# EAGLE design 3phase-boiler-controller-arduino (EAGLE 7.2.0)
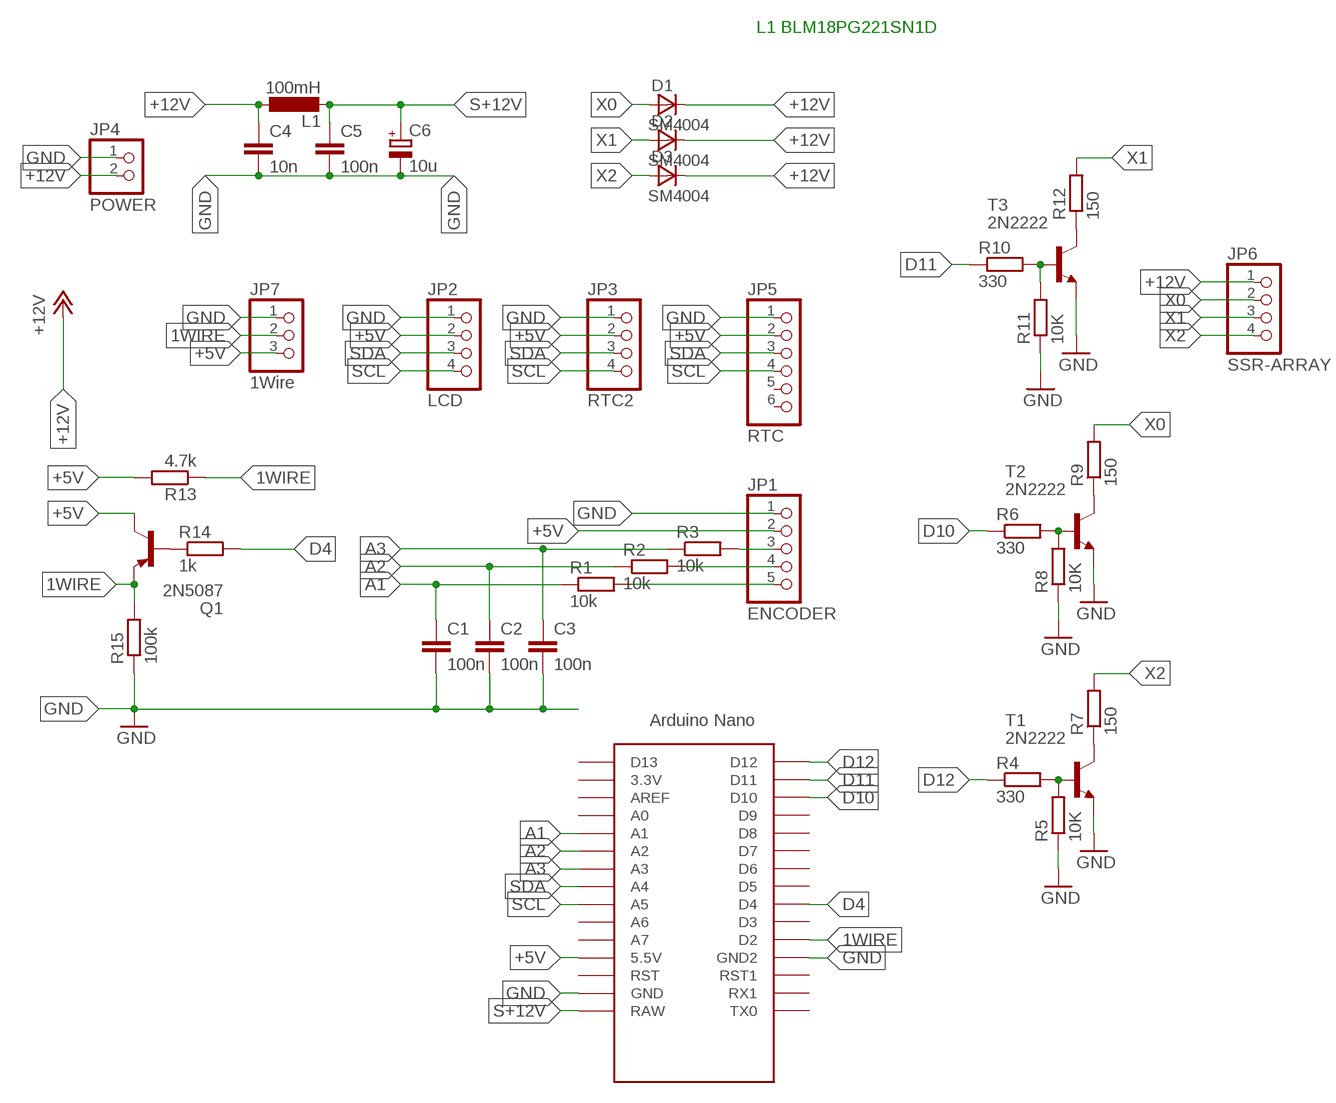
[diagram p0: schematic, sheet 1]

## Parts
C1  100n  C-EUC0603  [C0603]
C2  100n  C-EUC0603  [C0603]
C3  100n  C-EUC0603  [C0603]
C4  10n  C-EUC0603  [C0603]
C5  100n  C-EUC0603  [C0603]
C6  10u  CPOL-EU153CLV-0807  [153CLV-0807]
D1  SM4004  [MELF-MLL41]
D2  SM4004  [MELF-MLL41]
D3  SM4004  [MELF-MLL41]
JP1  ENCODER  PINHD-1X5  [1X05]
JP2  LCD  PINHD-1X4  [1X04]
JP3  RTC2  PINHD-1X4  [1X04]
JP4  POWER  PINHD-1X2  [1X02]
JP5  RTC  PINHD-1X6/90  [1X06/90]
JP6  SSR-ARRAY  PINHD-1X4  [1X04]
JP7  1Wire  PINHD-1X3  [1X03]
L1  100mH  L-EU0207/12  [0207/12]
Q1  2N5087  [TO92]
R1  10k  R-EU_R0805  [R0805]
R2  10k  R-EU_R0805  [R0805]
R3  10k  R-EU_R0805  [R0805]
R4  330  R-EU_R0805  [R0805]
R5  10K  R-EU_R0805  [R0805]
R6  330  R-EU_R0805  [R0805]
R7  150  R-EU_R0805  [R0805]
R8  10K  R-EU_R0805  [R0805]
R9  150  R-EU_R0805  [R0805]
R10  330  R-EU_R0805  [R0805]
R11  10K  R-EU_R0805  [R0805]
R12  150  R-EU_R0805  [R0805]
R13  4.7k  R-EU_R0805  [R0805]
R14  1k  R-EU_R0805  [R0805]
R15  100k  R-EU_R0805  [R0805]
T1  2N2222  [TO92-EBC-OVAL]
T2  2N2222  [TO92-EBC-OVAL]
T3  2N2222  [TO92-EBC-OVAL]
U$1  NANO  [NANO]

## Nets
1WIRE: JP7.2 Q1.3(E) R13.1 R15.2 U$1.D2
+5V: JP1.2 JP2.2 JP3.2 JP5.2 JP7.3 Q1.1(C) R13.2 U$1.5V(5.5V)
+12V: C4.1 D1.C D2.C D3.C JP4.2 JP6.1 L1.1
A1: C1.1 R1.1 U$1.A1
A2: C2.1 R2.1 U$1.A2
A3: C3.1 R3.1 U$1.A3
CLK: JP1.5 R1.2
D4: R14.2 U$1.D4
D10: R6.1 U$1.D10
D11: R10.1 U$1.D11
D12: R4.1 U$1.D12
DT: JP1.4 R2.2
GND: C1.2 C2.2 C3.2 C4.2 C5.2 C6.- JP1.1 JP2.1 JP3.1 JP4.1 JP5.1 JP7.1 R5.1 R8.1 R11.1 R15.1 T1.E T2.E T3.E U$1.GND U$1.GND1(GND2)
N$1: R6.2 R8.2 T2.B
N$2: R9.1 T2.C
N$3: R10.2 R11.2 T3.B
N$4: R12.1 T3.C
N$5: R4.2 R5.2 T1.B
N$7: R7.1 T1.C
N$13: Q1.2(B) R14.1
S+12V: C5.1 C6.+ L1.2 U$1.RAW
SCL: JP2.4 JP3.4 JP5.4 U$1.A5
SDA: JP2.3 JP3.3 JP5.3 U$1.A4
SW: JP1.3 R3.2
X0: D1.A JP6.2 R9.2
X1: D2.A JP6.3 R12.2
X2: D3.A JP6.4 R7.2
Unconnected: JP5.5 JP5.6 U$1.3.3V U$1.A0 U$1.A6 U$1.A7 U$1.AREF U$1.D3 U$1.D5 U$1.D6 U$1.D7 U$1.D8 U$1.D9 U$1.D13 U$1.ICSP1 U$1.ICSP2 U$1.ICSP3 U$1.ICSP4 U$1.ICSP5 U$1.ICSP6 U$1.RST U$1.RST1 U$1.RX1 U$1.TX0

## Notes on the sheet
- L1 BLM18PG221SN1D

## Library data of the parts
C1 = rcl:C-EU: CAPACITOR, European symbol; SPICEPREFIX: C
C2-C5 = rcl:C-EU: CAPACITOR, European symbol
C6 = rcl:CPOL-EU: POLARIZED CAPACITOR, European symbol
D1-D3 = _mod_diode:SM400*: SM4001 .. SM4007 General Purpose Rectifier, 1 A SMD-Version of 1N4001 .. 1N4007 Case: MELF-MLL41 = DO 213 AB Author: Dipl.-Ing. FH Rainer Bayer HHN Hochschule Heilbronn, rainer.bayer@hs-heilbronn.de Ingenieurbüro ing-rb, mail@ing-rb.de
JP1 = pinhead:PINHD-1X5: PIN HEADER
JP2 JP3 JP6 = pinhead:PINHD-1X4: PIN HEADER
JP4 = pinhead:PINHD-1X2: PIN HEADER
JP5 = pinhead:PINHD-1X6: PIN HEADER
JP7 = pinhead:PINHD-1X3: PIN HEADER
L1 = rcl:L-EU: INDUCTOR, European symbol
Q1 = transistor-pnp:2N5087: PNP Transistor
R1-R12 R14 R15 = rcl:R-EU_: RESISTOR, European symbol
R13 = resistor:R-EU_: RESISTOR, European symbol
T1-T3 = adafruit:2N2222: NPN TRANSISTOR Big oval pads
U$1 = Arduino-clone:NANO: Arduino Nano

## Net classes
0 default: clearance 0.205 mm

## Board
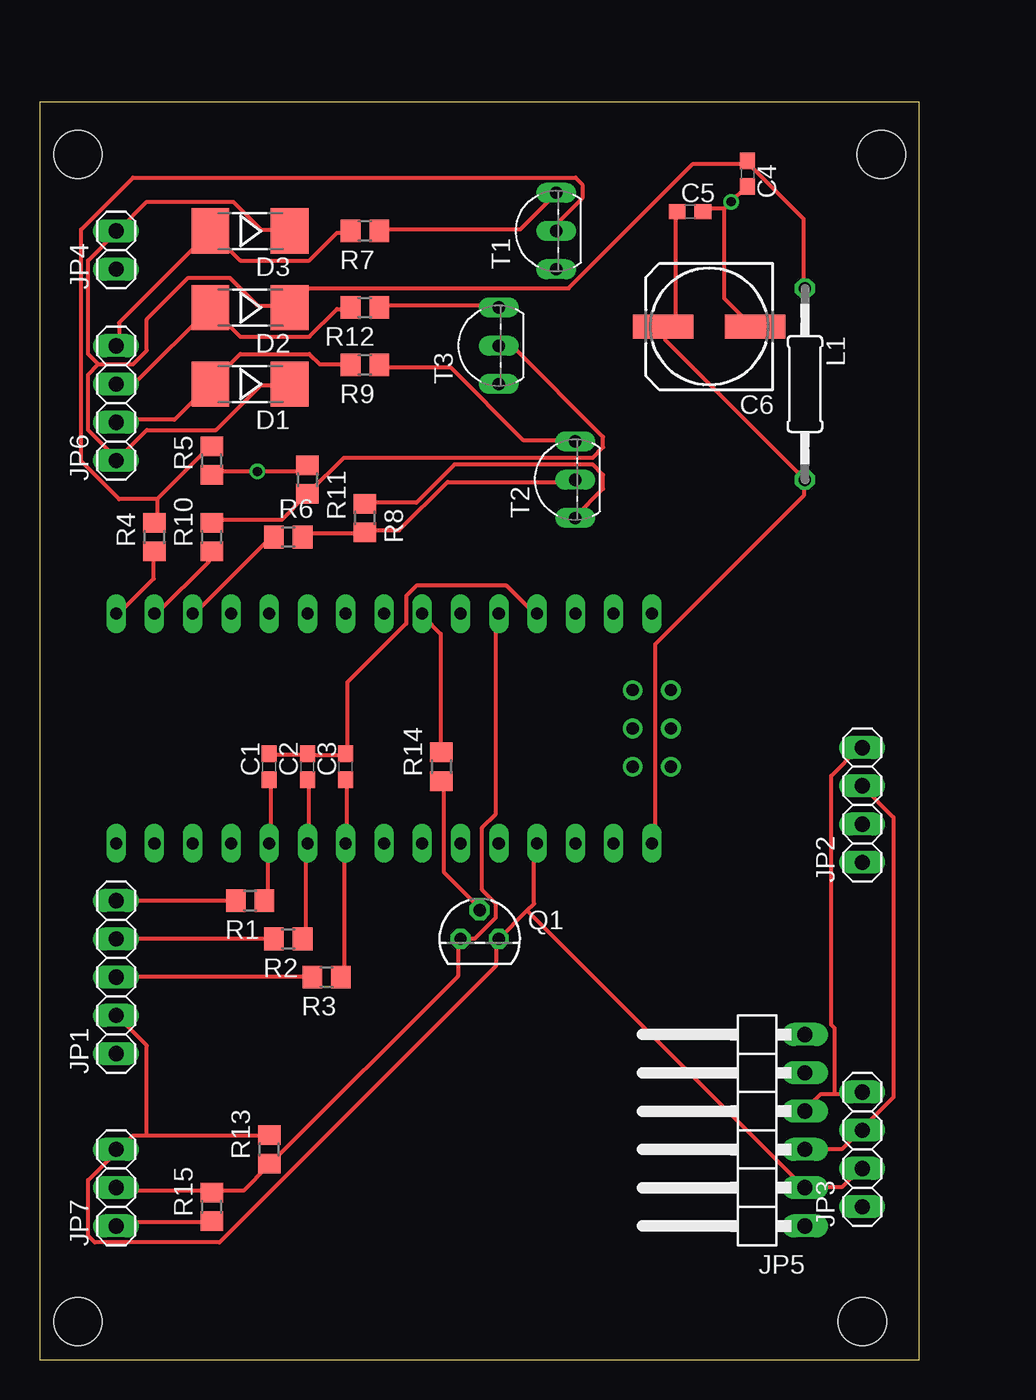
[diagram p1: board, top side]
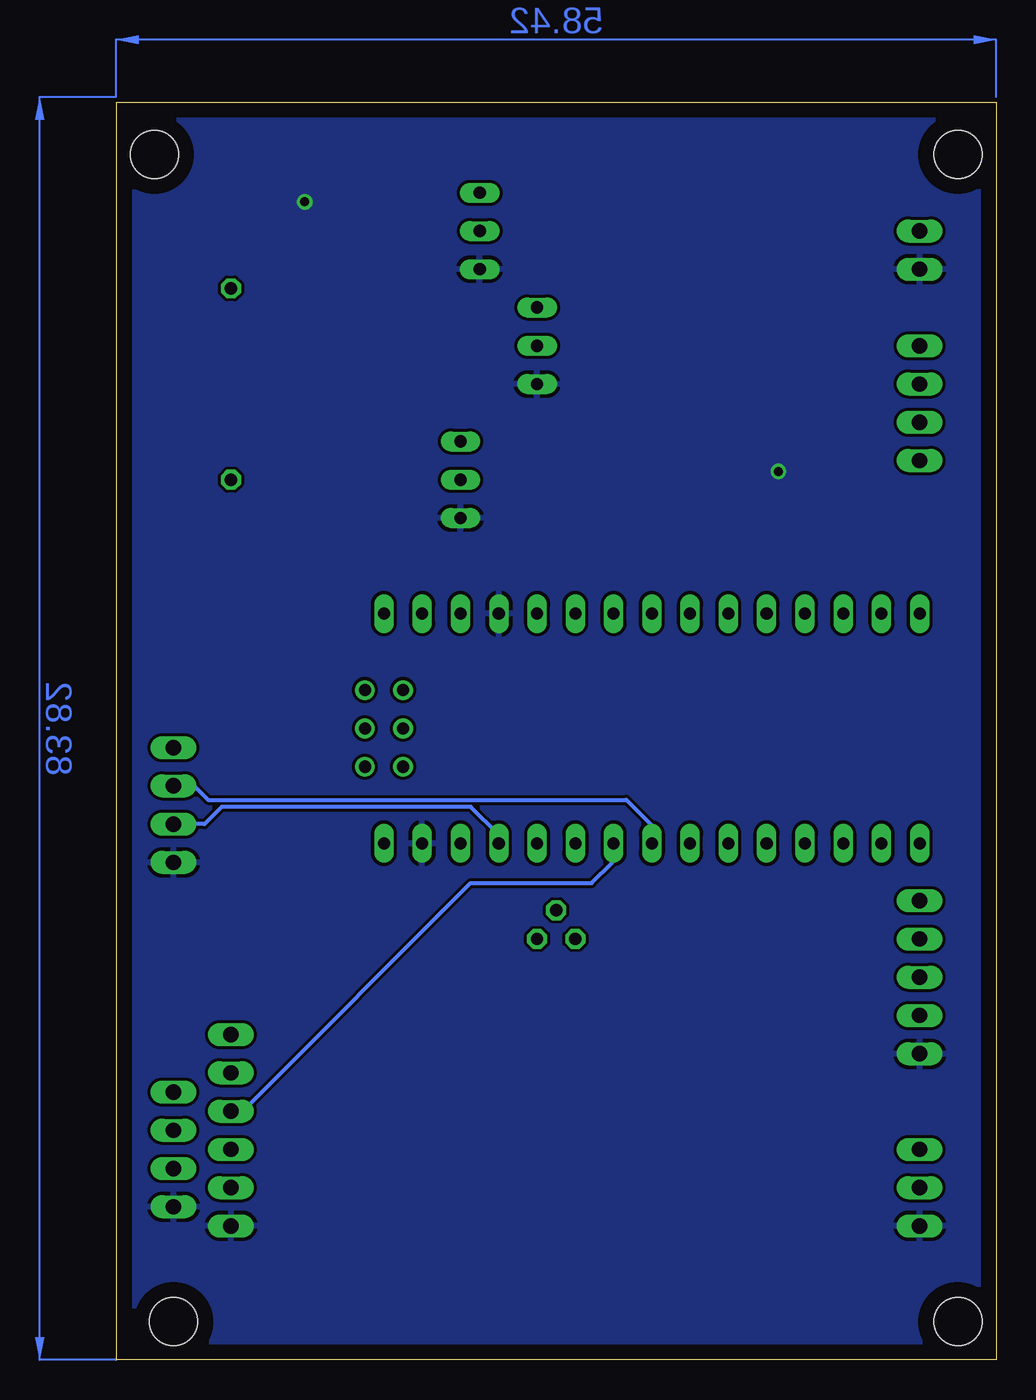
[diagram p2: board, bottom side, seen from below]

Size 58.4 x 83.49 mm. Coordinates in mm from the lower left corner, seen from the top.
Outline: 0,0 58.4,0 58.4,83.49 0,83.49 0,0
Copper layers (1*16): Top 0.035mm / dielectric 1.5mm / Bottom 0.035mm
Design rules "default": minimum track width 10mil, minimum drill 24mil, track to track 8mil, track to pad 8mil, pad to pad 8mil, via to via 8mil, smd to smd 8mil, copper to edge 40mil, drill to drill 8mil, minimum pad ring 10mil, minimum via ring 8mil, stop-mask expansion 4mil, vias tented up to drill 0mil, thermal gap 10mil
Holes 3.2 mm at 2.54,80.01 2.54,2.54 55.88,80.01 54.61,2.54

### Footprints (pad centres in the part's own frame; a part is rotated, then mirrored left to right if it is on the bottom)
C0603 = smd 1.1 x 1: 1 -0.85,0; 2 0.85,0
153CLV-0807 = smd 4 x 1.6: + 3.05,0; - -3.05,0
MELF-MLL41 = smd 2.5 x 3: A 2.625,0; C -2.625,0
1X05 = drill 1.016 long: 1 -5.08,0; 2 -2.54,0; 3 0,0; 4 2.54,0; 5 5.08,0
1X04 = drill 1.016 long: 1 -3.81,0; 2 -1.27,0; 3 1.27,0; 4 3.81,0
1X02 = drill 1.016 long: 1 -1.27,0; 2 1.27,0
1X06/90 = drill 1.016 long: 1 -6.35,-3.81; 2 -3.81,-3.81; 3 -1.27,-3.81; 4 1.27,-3.81; 5 3.81,-3.81; 6 6.35,-3.81
1X03 = drill 1.016 long: 1 -2.54,0; 2 0,0; 3 2.54,0
0207/12 = drill 0.813 octagon: 1 -6.35,0; 2 6.35,0
TO92 = drill 0.813 octagon: 1 1.27,0; 2 0,1.905; 3 -1.27,0
R0805 = smd 1.3 x 1.5: 1 -0.95,0; 2 0.95,0
TO92-EBC-OVAL = drill 0.813 long: B 0,-1.27; C 2.54,-1.27; E -2.54,-1.27
NANO = drill 0.8 long: 3.3V -10.16,24.13; 5V -10.16,-1.27; A0 -10.16,19.05; A1 -10.16,16.51; A2 -10.16,13.97; A3 -10.16,11.43; A4 -10.16,8.89; A5 -10.16,6.35; A6 -10.16,3.81; A7 -10.16,1.27; AREF -10.16,21.59; D2 5.08,1.27; D3 5.08,3.81; D4 5.08,6.35; D5 5.08,8.89; D6 5.08,11.43; D7 5.08,13.97; D8 5.08,16.51; D9 5.08,19.05; D10 5.08,21.59; D11 5.08,24.13; D12 5.08,26.67; D13 -10.16,26.67; GND -10.16,-6.35; GND1 5.08,-1.27; RAW -10.16,-8.89; RST -10.16,-3.81; RST1 5.08,-3.81; RX1 5.08,-6.35; TX0 5.08,-8.89 | drill 0.8: ICSP1 -5.08,-10.16; ICSP2 -5.08,-7.62; ICSP3 -2.54,-10.16; ICSP4 -2.54,-7.62; ICSP5 0,-10.16; ICSP6 0,-7.62

### Placement (x,y rotation side)
C1  15.24,39.37 90 top
C2  17.78,39.37 90 top
C3  20.32,39.37 90 top
C4  46.99,78.74 270 top
C5  43.18,76.2 0 top
C6  44.45,68.58 180 top
D1  13.97,64.77 180 top
D2  13.97,69.85 180 top
D3  13.97,74.93 180 top
JP1  5.08,25.4 90 top
JP2  54.61,36.83 90 top
JP3  54.61,13.97 90 top
JP4  5.08,73.66 90 top
JP5  46.99,15.24 90 top
JP6  5.08,63.5 90 top
JP7  5.08,11.43 90 top
L1  50.8,64.77 270 top
Q1  29.21,27.94 0 top
R1  13.97,30.48 180 top
R2  16.51,27.94 180 top
R3  19.05,25.4 180 top
R4  7.62,54.61 90 top
R5  11.43,59.69 90 top
R6  16.51,54.61 0 top
R7  21.59,74.93 180 top
R8  21.59,55.88 270 top
R9  21.59,66.04 180 top
R10  11.43,54.61 90 top
R11  17.78,58.42 270 top
R12  21.59,69.85 180 top
R13  15.24,13.97 90 top
R14  26.67,39.37 90 top
R15  11.43,10.16 90 top
T1  33.02,74.93 90 top
T2  34.29,58.42 90 top
T3  29.21,67.31 90 top
U$1  31.75,44.45 90 top

### Tracks (layer width: path | path; a pad name or v marks a point on that pad's centre or on a via)
1WIRE
  Top 0.254: JP7.2 5.28,11.23 11.24,11.23 R15.2 11.47,11.23 13.54,11.23 15.15,12.84 R13.1 15.38,13.07 27.77,25.46 27.77,27.75 Q1.3 28,27.98 28.92,27.98 30.29,29.36 30.29,30.28 29.38,31.2 29.38,35.33 30.29,36.24 30.29,49.33 U$1.D2
+5V
  Top 0.254: 7.11,14.9 6.2,14.9 5.28,13.98 JP7.3 5.05,13.75 3.21,11.92 3.21,8.25 3.67,7.79 11.93,7.79 30.29,26.15 30.29,27.75 Q1.1 32.36,29.82 | 7.11,14.9 15.15,14.9 R13.2 | 7.11,14.9 7.11,20.87 5.28,22.71 JP1.2 | JP3.2 54.39,12.61 53.24,11.46 50.95,11.46 JP5.2 50.72,11.46 32.36,29.82 | 32.36,29.82 32.82,30.28 32.82,34.18 U$1.5V
  Bottom 0.254: JP2.2 54.39,35.56 52.56,35.56 51.41,36.7 34.88,36.7 33.05,34.87 33.05,34.41 U$1.5V
+12V
  Top 0.254: D3.C 16.52,75.03 14.69,75.03 12.85,76.87 7.11,76.87 5.28,75.03 JP4.2 5.05,74.8 3.21,72.96 3.21,66.77 3.9,66.08 | L1.1 50.72,71.13 50.72,75.72 47.05,79.39 C4.1 46.82,79.39 43.38,79.39 35.11,71.13 17.9,71.13 16.75,69.98 D2.C 16.52,69.98 14.46,69.98 12.62,71.82 9.87,71.82 7.11,69.06 7.11,67 6.2,66.08 3.9,66.08 | D1.C 16.52,64.7 14.69,64.7 11.7,61.72 7.11,61.72 5.28,59.88 JP6.1 5.05,59.88 3.21,61.72 3.21,65.39 3.9,66.08
A1
  Top 0.254: C1.1 15.38,38.31 15.38,34.41 U$1.A1 15.15,34.18 15.15,30.51 R1.1
A2
  Top 0.254: C2.1 17.9,38.31 17.9,34.41 U$1.A2 17.67,34.18 17.67,27.98 R2.1
A3
  Top 0.254: C3.1 20.43,38.31 20.43,34.41 U$1.A3 20.2,34.18 20.2,25.46 R3.1
CLK
  Top 0.254: R1.2 12.85,30.51 5.28,30.51 JP1.5
D4
  Top 0.254: R14.2 26.62,40.38 26.62,48.18 25.47,49.33 U$1.D4
D10
  Top 0.254: R6.1 15.38,54.61 10.33,49.56 U$1.D10
D11
  Top 0.254: R10.1 11.24,53.46 11.24,53 7.8,49.56 U$1.D11
D12
  Top 0.254: R4.1 7.57,53.46 7.57,51.85 5.28,49.56 U$1.D12
DT
  Top 0.254: R2.2 15.38,27.98 5.28,27.98 JP1.4
GND  (via drill 0.61)
  Top 0.254: 45.44,76.41 44.06,76.41 C5.2 | 45.44,76.41 v45.9,76.87 46.82,77.78 C4.2 | 45.44,76.41 45.44,70.44 47.28,68.6 C6.- | R5.1 11.47,58.97 v14.46,58.97 17.44,58.97 17.67,59.2 R11.1 | C1.2 15.38,40.15 17.67,40.15 C2.2 17.9,40.15 20.2,40.15 C3.2 20.43,40.38 20.43,44.97 24.33,48.87 24.33,50.7 25.02,51.39 30.98,51.39 32.82,49.56 U$1.GND1 | R15.1 11.24,9.16 5.51,9.16 5.28,8.93 JP7.1 | R8.1 21.8,56.9 25.02,56.9 27.54,59.43 36.72,59.43 37.41,58.74 37.41,57.82 35.57,55.98 T2.E
  pour Bottom: 0,83.82 58.42,83.82 58.42,0 0,0
N$1
  Top 0.254: R6.2 17.67,54.84 21.57,54.84 R8.2 | 21.57,55.06 R8.2 | T2.B 35.34,58.28 27.08,58.28 23.87,55.06 21.8,55.06 R8.2
N$2
  Top 0.254: R9.1 22.72,65.85 27.31,65.85 32.13,61.03 35.34,61.03 T2.C
N$3
  Top 0.254: R10.2 11.47,55.75 16.07,55.75 17.67,57.36 R11.2 17.9,57.59 20.2,59.88 36.72,59.88 37.41,60.57 37.41,61.26 31.44,67.23 30.52,67.23 T3.B
N$4
  Top 0.254: R12.1 22.72,69.98 30.29,69.98 T3.C
N$5
  Top 0.254: 7.8,57.13 7.8,55.75 R4.2 | 7.8,57.13 11.24,60.57 R5.2 | 7.8,57.13 5.28,57.13 2.75,59.65 2.75,75.03 6.2,78.47 35.57,78.47 36.03,78.02 36.03,77.1 34.42,75.49 34.42,75.03 T1.B
N$7
  Top 0.254: R7.1 22.72,75.03 31.9,75.03 34.2,77.33 T1.C
N$13
  Top 0.254: R14.1 26.85,38.31 26.85,32.34 29.15,30.05 Q1.2
S+12V
  Top 0.254: C5.1 42.23,76.18 42.23,69.29 41.54,68.6 C6.+ 41.54,68.38 41.54,67.69 50.72,58.51 L1.2 50.72,58.28 50.72,57.36 40.85,47.49 40.85,34.41 U$1.RAW
SCL
  Top 0.254: 52.78,17.66 51.87,17.66 50.95,16.74 JP5.4 | 52.78,17.66 54.39,17.66 JP3.4 | 52.78,17.66 52.78,22.02 52.56,22.25 52.56,38.77 54.39,40.61 JP2.4
  Bottom 0.254: U$1.A5 25.47,34.18 25.47,33.03 26.85,31.66 34.88,31.66 49.8,16.74 50.72,16.74 JP5.4
SDA
  Top 0.254: JP5.3 50.95,13.98 53.24,13.98 54.39,15.13 JP3.3 54.62,15.36 56.69,17.43 56.69,36.02 54.62,38.08 JP2.3
  Bottom 0.254: U$1.A4 22.95,34.41 22.95,35.56 24.56,37.16 52.33,37.16 53.24,38.08 54.39,38.08 JP2.3
SW
  Top 0.254: R3.2 17.9,25.46 5.28,25.46 JP1.3
X0
  Top 0.254: R9.2 20.43,66.08 18.59,66.08 17.9,66.77 13.31,66.77 11.47,64.93 D1.A 11.24,64.7 8.95,62.41 5.28,62.41 JP6.2
X1
  Top 0.254: R12.2 20.43,69.75 19.74,69.75 17.9,67.92 13.31,67.92 11.47,69.75 D2.A 11.24,69.75 6.43,64.93 5.28,64.93 JP6.3
X2
  Top 0.254: R7.2 20.43,74.8 19.74,74.8 17.9,72.96 13.31,72.96 11.47,74.8 D3.A 11.24,74.8 5.28,68.83 5.28,67.46 JP6.4
(copper drawn outside any net)
  shapes: Bottom area x2